# Altium schematic sheet Fibernet.SchDoc
size A4
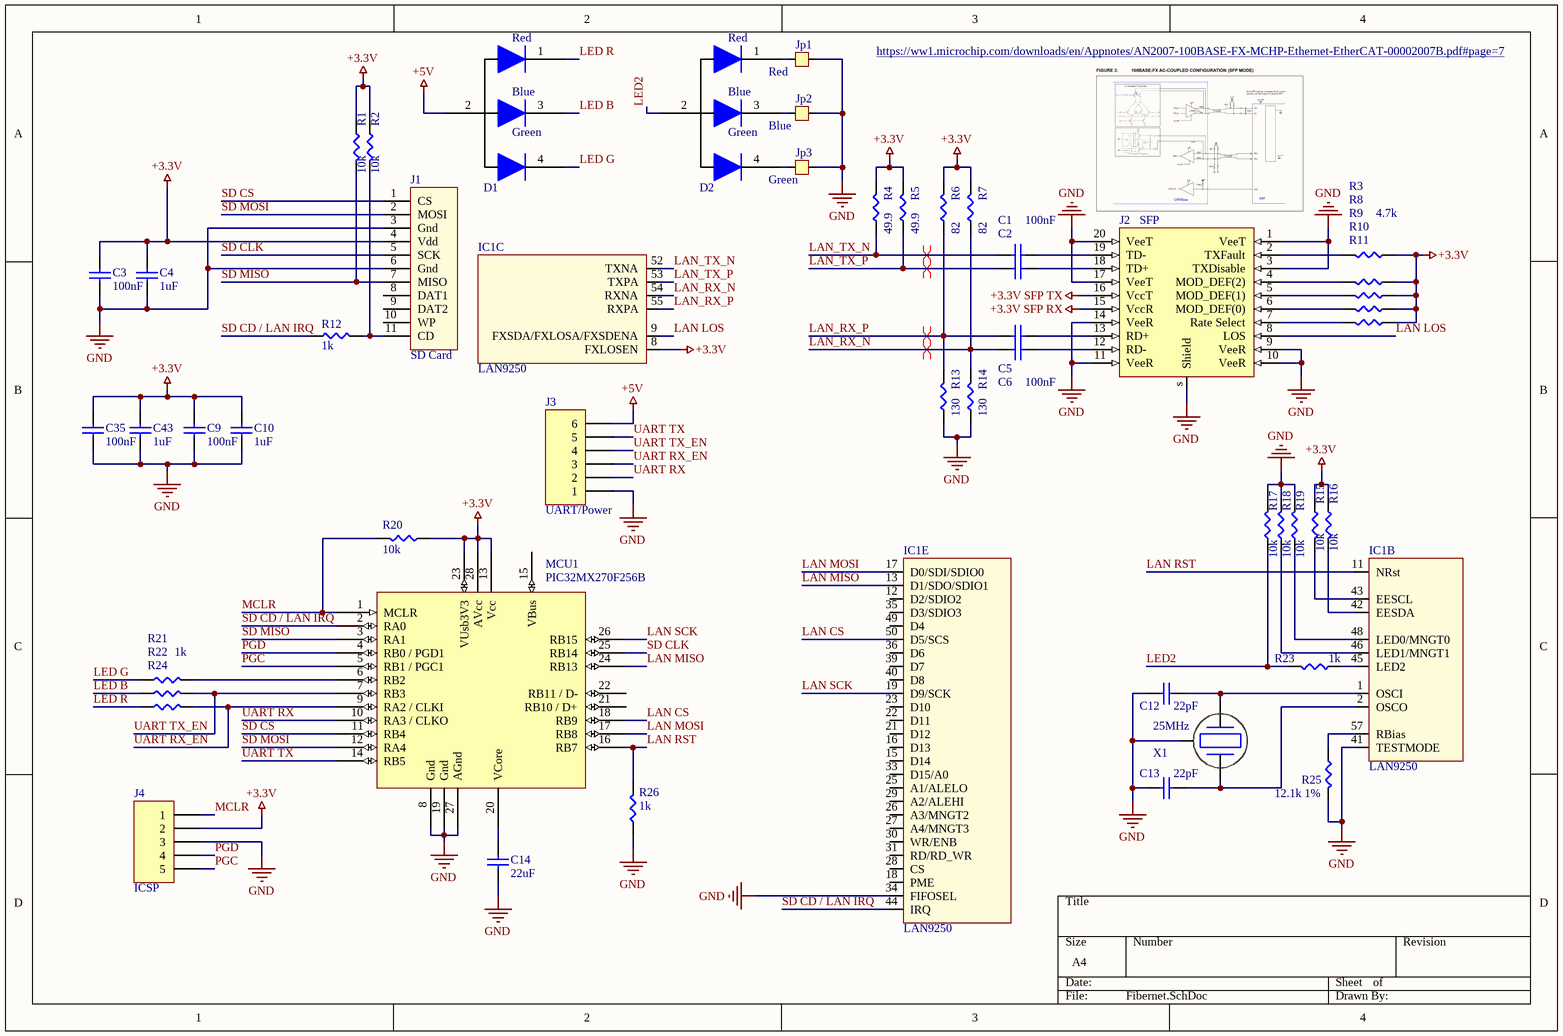
[diagram p0: Fibernet.SchDoc]

## Parts
C1  100nF  [0402]
C2  100nF  [0402]  (value not drawn)
C3  100nF  [0402]
C4  1uF  [0402]
C5  100nF  [0402]
C6  100nF  [0402]  (value not drawn)
C9  100nF  [0402]
C10  1uF  [0402]
C12  22pF  [0402]
C13  22pF  [0402]
C14  22uF  [0603]
C35  100nF  [0402]
C43  1uF  [0402]
D1  RGB LED Common anode  [1411]  (value not drawn)
D2  RGB LED Common anode  [1411]  (value not drawn)
IC1  LAN9250  [QFN64]  (parts B,C,E of 5)
J1  SD Card  [MEM2075]
J2  SFP  [SFP Con and Cage]
J3  UART/Power  [HDR1X6]
J4  ICSP  [HDR1X5]
Jp1  Red  [PCB Jumper NO]
Jp2  Blue  [PCB Jumper NO]
Jp3  Green  [PCB Jumper NO]
MCU1  PIC32MX270F256B  [TSSOP28_Wide]
R1  10k  [0402]
R2  10k  [0402]
R3  4.7k  [0402]
R4  49.9  [0402]
R5  49.9  [0402]
R6  82  [0402]
R7  82  [0402]
R8  4.7k  [0402]  (value not drawn)
R9  4.7k  [0402]  (value not drawn)
R10  4.7k  [0402]  (value not drawn)
R11  4.7k  [0402]  (value not drawn)
R12  1k  [0402]
R13  130  [0402]
R14  130  [0402]
R15  10k  [0402]
R16  10k  [0402]
R17  10k  [0402]
R18  10k  [0402]
R19  10k  [0402]
R20  10k  [0402]
R21  1k  [0402]
R22  1k  [0402]  (value not drawn)
R23  1k  [0402]
R24  1k  [0402]  (value not drawn)
R25  12.1k 1%  [0402]
R26  1k  [0402]
X1  25MHz  [ECS-3225MV Oscillator]

## Nets
+3.3V: C3.2 C4.2 C9.2 C10.2 C35.2 C43.2 IC1.8(FXLOSEN) J1.4(Vdd) J4.2 MCU1.13(Vcc) MCU1.23(VUsb3V3) MCU1.28(AVcc) R1.1 R2.1 R3.2 R4.1 R5.1 R6.1 R7.1 R8.2 R9.2 R10.2 R11.2 R15.1 R16.1 R20.1
+3.3V SFP RX: J2.15(VccR)
+3.3V SFP TX: J2.16(VccT)
+5V: D1.2 J3.6
GND: C3.1 C4.1 C9.1 C10.1 C12.1 C13.1 C14.1 C35.1 C43.1 IC1.34(FIFOSEL) IC1.41(TESTMODE) J1.3(Gnd) J1.6(Gnd) J2.1(VeeT) J2.3(TXDisable) J2.9(VeeR) J2.10(VeeR) J2.11(VeeR) J2.14(VeeR) J2.17(VeeT) J2.20(VeeT) J2.s(Shield) J3.1 J4.3 Jp1.2 Jp2.2 Jp3.2 MCU1.8(Gnd) MCU1.19(Gnd) MCU1.27(AGnd) R13.2 R14.2 R17.1 R18.1 R19.1 R25.1 R26.2 X1.3(Shield)
LAN CS: IC1.50(D5/SCS) MCU1.18(RB9)
LAN LOS: IC1.9(FXSDA/FXLOSA/FXSDENA) J2.8(LOS)
LAN MISO: IC1.13(D1/SDO/SDIO1) MCU1.24(RB13)
LAN MOSI: IC1.17(D0/SDI/SDIO0) MCU1.17(RB8)
LAN RST: IC1.11(NRst) MCU1.16(RB7) R26.1
LAN SCK: IC1.19(D9/SCK) MCU1.26(RB15)
LAN_RX_N: C6.1 IC1.54(RXNA) R7.2 R14.1
LAN_RX_P: C5.1 IC1.55(RXPA) R6.2 R13.1
LAN_TX_N: C1.1 IC1.52(TXNA) R4.2
LAN_TX_P: C2.1 IC1.53(TXPA) R5.2
LED2: D2.2 R17.2 R23.1
LED B: D1.3 R22.2
LED G: D1.4 R21.2
LED R: D1.1 R24.2
MCLR: J4.1 MCU1.1(MCLR) R20.2
PGC: J4.5 MCU1.5(RB1_/_PGC1)
PGD: J4.4 MCU1.4(RB0_/_PGD1)
SD CD / LAN IRQ: IC1.44(IRQ) MCU1.2(RA0) R12.1
SD CLK: J1.5(SCK) MCU1.25(RB14)
SD CS: J1.1(CS) MCU1.11(RB4)
SD MISO: J1.7(MISO) MCU1.3(RA1) R1.2
SD MOSI: J1.2(MOSI) MCU1.12(RA4)
UART RX: J3.2 MCU1.10(RA3_/_CLKO)
UART RX_EN: J3.3 MCU1.9(RA2_/_CLKI) R24.1
UART TX: J3.5 MCU1.14(RB5)
UART TX_EN: J3.4 MCU1.7(RB3) R22.1
NetC1_2: C1.2 J2.19(TD-)
NetC2_2: C2.2 J2.18(TD+)
NetC5_2: C5.2 J2.13(RD+)
NetC6_2: C6.2 J2.12(RD-)
NetC12_2: C12.2 IC1.1(OSCI) X1.2
NetC13_2: C13.2 IC1.2(OSCO) X1.1
NetC14_2: C14.2 MCU1.20(VCore)
NetD2_1: D2.1 Jp1.1
NetD2_3: D2.3 Jp2.1
NetD2_4: D2.4 Jp3.1
NetIC1_42: IC1.42(EESDA) R16.2
NetIC1_43: IC1.43(EESCL) R15.2
NetIC1_45: IC1.45(LED2) R23.2
NetIC1_46: IC1.46(LED1/MNGT1) R18.2
NetIC1_48: IC1.48(LED0/MNGT0) R19.2
NetIC1_57: IC1.57(RBias) R25.2
NetJ1_11: J1.11(CD) R2.2 R12.2
NetJ2_2: J2.2(TXFault) R3.1
NetJ2_4: J2.4(MOD_DEF(2)) R10.1
NetJ2_5: J2.5(MOD_DEF(1)) R8.1
NetJ2_6: J2.6(MOD_DEF(0)) R9.1
NetJ2_7: J2.7(Rate_Select) R11.1
NetMCU1_6: MCU1.6(RB2) R21.1

Not connected (* = marked no-connect by the designer): IC1 12(D2/SDIO2) 15(D14) 16(D13) 18(PME) 21(D12) 22(D11) 23(D10) 25(A1/ALELO) 26(A3/MNGT2) 27(A4/MNGT3) 28(CS) 29(A2/ALEHI) 30(WR/ENB) 31(RD/RD_WR) 33(D15/A0) 35(D3/SDIO3) 36(D6) 39(D7) 40(D8) 49(D4); J1 8(DAT1) 9(DAT2) 10(WP); MCU1 15(VBus) 21(RB10_/_D+) 22(RB11_/_D-)

## Layout directives
differential pair: LAN_RX_N, LAN_RX_P, LAN_TX_N, LAN_TX_P

## Notes on the sheet
- https://ww1.microchip.com/downloads/en/Appnotes/AN2007-100BASE-FX-MCHP-Ethernet-EtherCAT-00002007B.pdf#page=7
- (in symbol RGB LED) Red; Blue; Green

## Library data of the parts
C1-C6 C9 C10 C12-C14 C35 C43 = Cap: Supplier 1: Digi-Key; Supplier 2: Digi-Key; Supplier 3: Digi-Key; Supplier Part Number 1: 1276-2044-1-ND; Supplier Part Number 2: 1276-1018-1-ND; Supplier Part Number 3: 1276-1182-1-ND; Supplier 4: Digi-Key; Supplier 5: Digi-Key; Supplier 6: Digi-Key; Supplier 7: Digi-Key; Supplier 8: Digi-Key; Supplier 9: Digi-Key; Supplier Part Number 4: 1276-1009-1-ND; Supplier Part Number 5: 1276-1098-1-ND; Supplier Part Number 6: 1276-1119-1-ND; Supplier Part Number 7: 490-12737-1-ND; Supplier Part Number 9: 587-1249-1-ND; Supplier Part Number 8: 1276-1183-1-ND; Supplier 10: Digi-Key; Supplier 11: Digi-Key; Supplier 12: Digi-Key; Supplier 13: Digi-Key; Supplier Part Number 10: 1276-CL10B104KB8NNNLCT-ND; Supplier Part Number 11: 399-1085-1-ND; Supplier Part Number 13: 587-2985-1-ND; Supplier Part Number 12: 1276-1021-1-ND; Supplier 14: Digi-Key; Supplier 15: Digi-Key; Supplier 16: Digi-Key; Supplier 17: Digi-Key; Supplier 18: Digi-Key; Supplier 19: Digi-Key; Supplier Part Number 14: 490-14603-1-ND; Supplier Part Number 15: 311-3700-1-ND; Supplier Part Number 16: 311-1042-1-ND; Supplier Part Number 17: 311-1415-1-ND; Supplier Part Number 19: 587-4321-1-ND; Supplier Part Number 18: 1276-1907-1-ND
  C1 C2 C5 C6 C9 C10 C12-C14 C35 C43: Supplier 20: Digi-Key; Supplier 21: Digi-Key; Supplier 22: Digi-Key; Supplier Part Number 20: 1276-6767-1-ND; Supplier Part Number 21: 1276-7060-1-ND; Supplier Part Number 22: 311-1084-1-ND
D1 D2 = RGB LED: RGB LED Invered; pin to pad: 1>4 2>1 4>2
IC1 = LAN9250: 10/100 Ethernet controller & PHY; ComponentLink1Description: Datasheet; ComponentLink1URL: https://ww1.microchip.com/downloads/en/DeviceDoc/00001913A.pdf; Supplier 1: Digi-Key; Supplier Part Number 1: LAN9250/ML-ND
J1 = SD Card: pin to pad: 1>2 2>3 3>6 6>none 9>none 10>none 11>9; Supplier 1: Digi-Key; Supplier Part Number 1: 609-3956-1-ND; Supplier 2: Digi-Key; Supplier Part Number 2: 2073-MEM2075-00-140-01-ACT-ND
J2 = SFP Connector: SFP Connector with cage; Supplier 1: Digi-Key; Supplier 2: Digi-Key; Supplier Part Number 1: UE75-A20-6000TCT-ND; Supplier Part Number 2: U77-A1118-200TCT-ND
J3 = Header 6: Header, 6-Pin; LatestRevisionDate: 17-Jul-2002; LatestRevisionNote: Re-released for DXP Platform.; Publisher: Altium Limited
J4 = Header 5: Header, 5-Pin; LatestRevisionDate: 17-Jul-2002; LatestRevisionNote: Re-released for DXP Platform.; Publisher: Altium Limited
Jp1-Jp3 = Jumper
MCU1 = PIC32MX2xxFxxxB: 32Bit pic with usb; Supplier 1: Digi-Key; Supplier Part Number 1: PIC32MX270F256B-I/SS-ND
R1-R26 = Resistor
X1 = Quarz crystal: pin to pad: 1>2 2>4 3>1+3; Supplier 1: Digi-Key; Supplier Part Number 1: SER4069TR-ND